# EAGLE schematic tarocco-v1 (EAGLE 7.3.0)
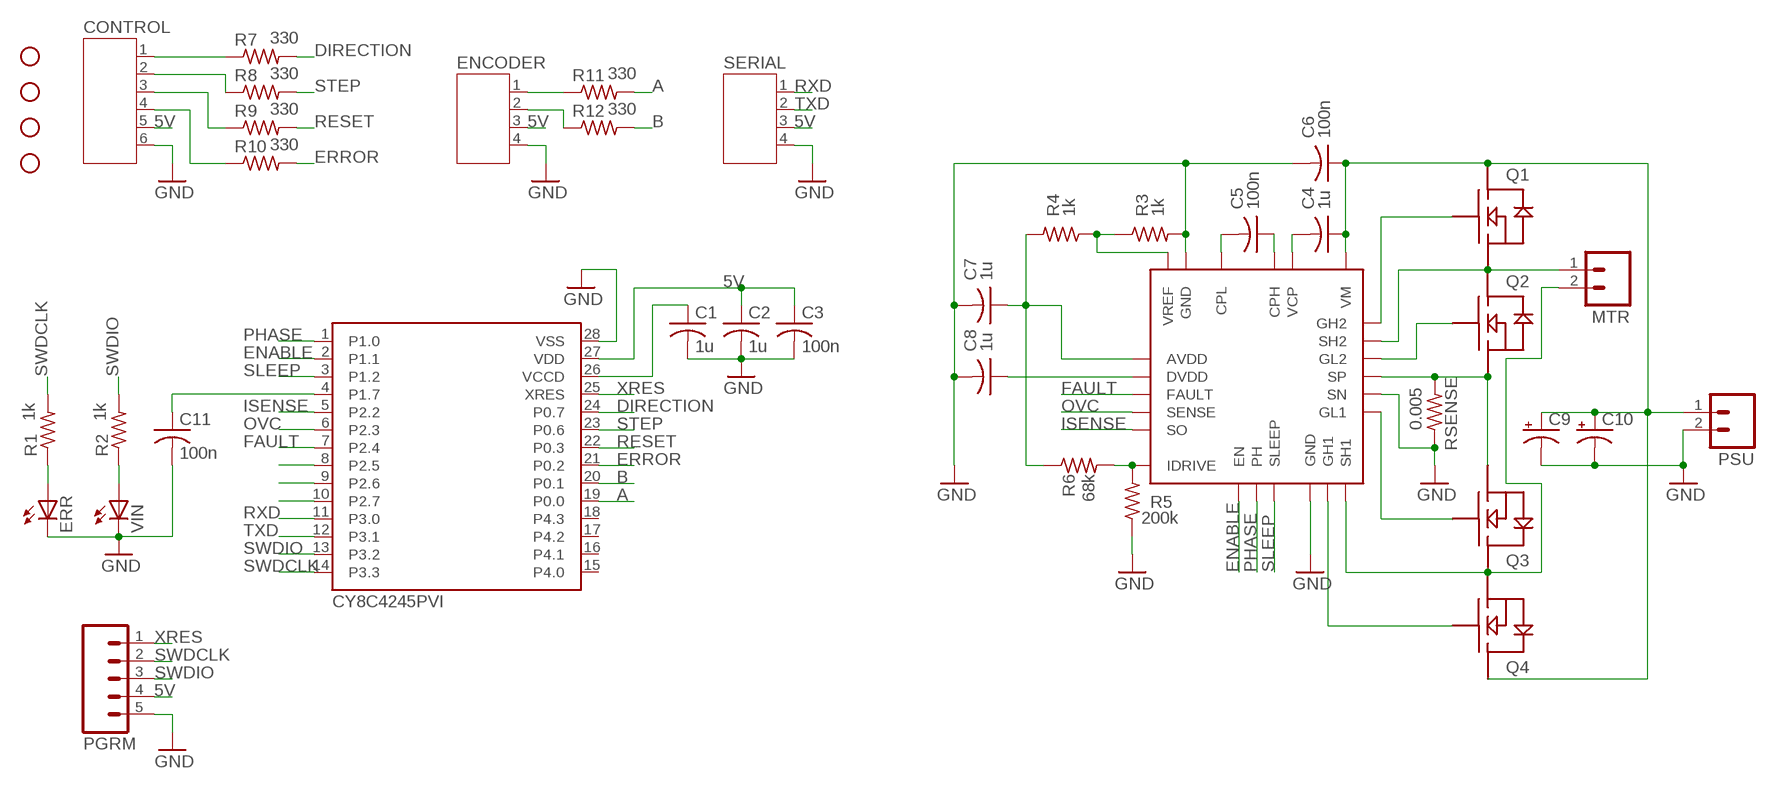
[diagram p0: schematic, sheet 1]

## Parts
8701  DRV8701  [VQFN24]
C1  1u  C-USC0603  [C0603]
C2  1u  C-USC0603  [C0603]
C3  100n  C-USC0603  [C0603]
C4  1u  C-USC0603  [C0603]
C5  100n  C-USC0603  [C0603]
C6  100n  C-USC0603  [C0603]
C7  1u  C-USC0603  [C0603]
C8  1u  C-USC0603  [C0603]
C9  CPOL-USE3.5-8  [E3,5-8]
C10  CPOL-USE3.5-8  [E3,5-8]
C11  100n  C-USC0603  [C0603]
CONTROL  JST-PH6  [JST-PH6]
ENCODER  JST-PH4  [JST-PH4]
ERR  LEDCHIP-LED0603  [CHIP-LED0603]
IC1  CY8C4545PVI  [SSOP28]
MTR  M023.5MM  [SCREWTERMINAL-3.5MM-2]
PGRM  M05SMD2  [1X05-1MM-RA]
PSU  M023.5MM  [SCREWTERMINAL-3.5MM-2]
Q1  NEXFET_SINGLECSD18537NQ5A  [SON5X6]
Q2  NEXFET_SINGLECSD18537NQ5A  [SON5X6]
Q3  NEXFET_SINGLECSD18537NQ5A  [SON5X6]
Q4  NEXFET_SINGLECSD18537NQ5A  [SON5X6]
R1  1k  R-US_R0603  [R0603]
R2  1k  R-US_R0603  [R0603]
R3  1k  R-US_R0603  [R0603]
R4  1k  R-US_R0603  [R0603]
R5  200k  R-US_R0603  [R0603]
R6  68k  R-US_R0603  [R0603]
R7  330  R-US_R0603  [R0603]
R8  330  R-US_R0603  [R0603]
R9  330  R-US_R0603  [R0603]
R10  330  R-US_R0603  [R0603]
R11  330  R-US_R0603  [R0603]
R12  330  R-US_R0603  [R0603]
RSENSE  0.005  R-US_R2512  [R2512]
SERIAL  JST-PH4  [JST-PH4]
STANDOFF1  STAND-OFF  [STAND-OFF]
STANDOFF2  STAND-OFF  [STAND-OFF]
STANDOFF3  STAND-OFF  [STAND-OFF]
STANDOFF4  STAND-OFF  [STAND-OFF]
VIN  LEDCHIP-LED0603  [CHIP-LED0603]

## Nets
5V: C2.1 C3.1 CONTROL.5 ENCODER.3 IC1.27(VDD) PGRM.4 SERIAL.3
A: IC1.19(P0.0) R11.2
B: IC1.20(P0.1) R12.2
DIRECTION: IC1.24(P0.7) R7.2
ENABLE: 8701.EN IC1.2(P1.1)
ERROR: IC1.21(P0.2) R10.2
FAULT: 8701.FAULT IC1.7(P2.4)
GND: 8701.GND@1(GND) 8701.GND@2(GND) 8701.GND@3(GND) 8701.SN C1.2 C2.2 C3.2 C6.2 C7.2 C8.2 C9.- C10.- C11.2 CONTROL.6 ENCODER.4 ERR.C IC1.28(VSS) PGRM.5 PSU.2 R3.2 R5.1 RSENSE.1 SERIAL.4 VIN.C
ISENSE: 8701.SO IC1.5(P2.2)
N$1: 8701.GL1 Q3.GATE
N$2: 8701.SH1 MTR.2 Q3.DRAIN@1(DRAIN) Q3.DRAIN@2(DRAIN) Q3.DRAIN@3(DRAIN) Q3.DRAIN@4(DRAIN) Q3.DRAIN@5(DRAIN) Q4.SOURCE@1(SOURCE) Q4.SOURCE@2(SOURCE) Q4.SOURCE@3(SOURCE)
N$3: 8701.SH2 MTR.1 Q1.SOURCE@1(SOURCE) Q1.SOURCE@2(SOURCE) Q1.SOURCE@3(SOURCE) Q2.DRAIN@1(DRAIN) Q2.DRAIN@2(DRAIN) Q2.DRAIN@3(DRAIN) Q2.DRAIN@4(DRAIN) Q2.DRAIN@5(DRAIN)
N$4: 8701.GH2 Q1.GATE
N$5: 8701.SP Q2.SOURCE@1(SOURCE) Q2.SOURCE@2(SOURCE) Q2.SOURCE@3(SOURCE) Q3.SOURCE@1(SOURCE) Q3.SOURCE@2(SOURCE) Q3.SOURCE@3(SOURCE) RSENSE.2
N$6: 8701.GL2 Q2.GATE
N$7: 8701.GH1 Q4.GATE
N$8: ENCODER.1 R11.1
N$10: ENCODER.2 R12.1
N$11: 8701.VCP C4.2
N$12: 8701.CPL C5.2
N$13: 8701.CPH C5.1
N$14: CONTROL.1 R7.1
N$15: 8701.VREF R3.1 R4.1
N$16: 8701.AVDD C7.1 R4.2 R6.1
N$17: 8701.DVDD C8.1
N$18: CONTROL.2 R8.1
N$19: C1.1 IC1.26(VCCD)
N$20: CONTROL.3 R9.1
N$21: 8701.IDRIVE R5.2 R6.2
N$22: CONTROL.4 R10.1
N$23: 8701.VM C4.1 C6.1 C9.+ C10.+ PSU.1 Q1.DRAIN@1(DRAIN) Q1.DRAIN@2(DRAIN) Q1.DRAIN@3(DRAIN) Q1.DRAIN@4(DRAIN) Q1.DRAIN@5(DRAIN) Q4.DRAIN@1(DRAIN) Q4.DRAIN@2(DRAIN) Q4.DRAIN@3(DRAIN) Q4.DRAIN@4(DRAIN) Q4.DRAIN@5(DRAIN)
N$24: ERR.A R1.1
N$25: R2.1 VIN.A
N$29: C11.1 IC1.4(P1.7)
N$33: IC1.8(P2.5)
N$34: IC1.9(P2.6)
N$35: IC1.10(P2.7)
OVC: 8701.SENSE IC1.6(P2.3)
PHASE: 8701.PH IC1.1(P1.0)
RESET: IC1.22(P0.3) R9.2
RXD: IC1.11(P3.0) SERIAL.1
SLEEP: 8701.SLEEP IC1.3(P1.2)
STEP: IC1.23(P0.6) R8.2
SWDCLK: IC1.14(P3.3) PGRM.2 R1.2
SWDIO: IC1.13(P3.2) PGRM.3 R2.2
TXD: IC1.12(P3.1) SERIAL.2
XRES: IC1.25(XRES) PGRM.1
Unconnected: IC1.15(P4.0) IC1.16(P4.1) IC1.17(P4.2) IC1.18(P4.3)

## Notes on the sheet
- CY8C4245PVI

## Library data of the parts
8701 = drv8x:DRV8701
C1-C8 C11 = adafruit:C-US: CAPACITOR, American symbol
C9 C10 = adafruit:CPOL-US: POLARIZED CAPACITOR, American symbol
CONTROL = jst-ph:JST-PH6
ENCODER SERIAL = jst-ph:JST-PH4
ERR VIN = adafruit:LED: LED OSRAM: - CHIPLED LG R971, LG N971, LY N971, LG Q971, LY Q971, LO R971, LY R971 LH N974, LH R974 LS Q976, LO Q976, LY Q976 LO Q996 - Hyper CHIPLED LW Q18S LB Q993, LB Q99A, LB R99A - SideLED LS A670, LO A670, LY A670, LG A670, LP A670 LB A673, LV A673, LT A673, LW A673 LH A674 LY A675 LS A676, LA A676, LO A676, LY A676, LW A676 LS A679, LY A679, LG A679 - Hyper Micro SIDELED® LS Y876, LA Y876, LO Y876, LY Y876 LT Y87S - SmartLED LW L88C, LW L88S LB L89C, LB L89S, LG L890 LS L89K, LO L89K, LY L89K LS L896, LA L896, LO L896, LY L896 - TOPLED LS T670, LO T670, LY T670, LG T670, LP T670 LSG T670, LSP T670, LSY T670, LOP T670, LYG T670 LG T671, LOG T671, LSG T671 LB T673, LV T673, LT T673, LW T673 LH T674 LS T676, LA T676, LO T676, LY T676, LB T676, LH T676, LSB T676, LW T676 LB T67C, LV T67C, LT T67C, LS T67K, LO T67K, LY T67K, LW E67C LS E67B, LA E67B, LO E67B, LY E67B, LB E67C, LV E67C, LT E67C LW T67C LS T679, LY T679, LG T679 LS T770, LO T770, LY T770, LG T770, LP T770 LB T773, LV T773, LT T773, LW T773 LH T774 LS E675, LA E675, LY E675, LS T675 LS T776, LA T776, LO T776, LY T776, LB T776 LHGB T686 LT T68C, LB T68C - Hyper Mini TOPLED® LB M676 - Mini TOPLED Santana® LG M470 LS M47K, LO M47K, LY M47K Source: http://www.osram.convergy.de/
IC1 = CY8C4200:CY8C4545PVI: CY8C4245 SSOP-28
MTR PSU = SparkFun-Connectors:M02: Standard 2-pin 0.1" header. Use with - straight break away headers ( PRT-00116) - right angle break away headers (PRT-00553) - swiss pins (PRT-00743) - machine pins (PRT-00117) - female headers (PRT-00115) Molex polarized connector foot print use with: PRT-08233 with associated crimp pins and housings. 2.54_SCREWTERM for use with PRT-10571. 3.5mm Screw Terminal footprints for PRT-08084 5mm Screw Terminal footprints for use with PRT-08432
PGRM = SparkFun-Connectors:M05: Header 5 Standard 5-pin 0.1" header. Use with straight break away headers (SKU : PRT-00116), right angle break away headers (PRT-00553), swiss pins (PRT-00743), machine pins (PRT-00117), and female headers (PRT-00115). Molex polarized connector foot print use with SKU : PRT-08230 with associated crimp pins and housings.
Q1-Q4 = mosfet:NEXFET_SINGLE
R1-R12 RSENSE = adafruit:R-US_: RESISTOR, American symbol
STANDOFF1-STANDOFF4 = SparkFun-Electromechanical:STAND-OFF: #4 Stand Off This is the mechanical footprint for a #4 phillips button head screw. Use the keepout ring to avoid running the screw head into surrounding components. SKU : PRT-00447